# Altium schematic sheet Misc.SchDoc: F1C100S-Misc
size A4
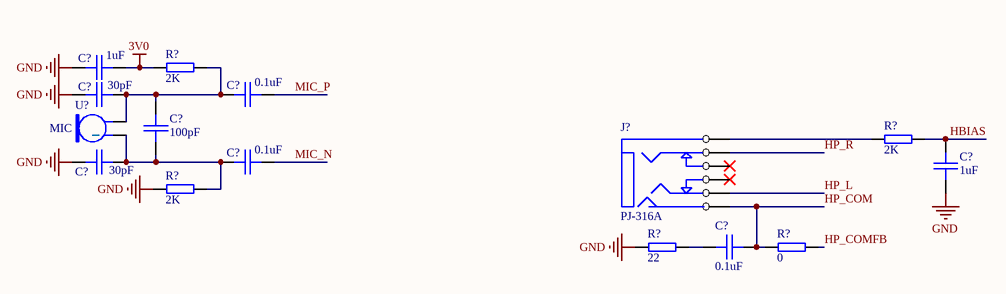
[diagram p0: Misc.SchDoc]

## Parts
(Parts that share a designator on the sheet are numbered #1, #2 ... from top to bottom, then left to right.)
C?#1  1uF  [CAP-0603]
C?#2  30pF  [CAP-0603]
C?#3  0.1uF  [CAP-0603]
C?#4  100pF  [CAP-0603]
C?#5  30pF  [CAP-0603]
C?#6  0.1uF  [CAP-0603]
C?#7  1uF  [CAP-0603]
C?#8  0.1uF  [CAP-0603]
J?  PJ-316A  [PJ-316A]
R?#1  2K  [RES-0603]
R?#2  2K  [RES-0603]
R?#3  2K  [RES-0603]
R?#4  22  [RES-0603]
R?#5  0  [RES-0603]
U?  MIC  [MIC_9767]

## Nets
3V0: C?#1.2 R?#1.1
GND: C?#1.1 C?#2.1 C?#5.1 C?#7.1 R?#3.1 R?#4.1
HBIAS: C?#7.2 R?#2.2
HP_COM: C?#8.2 J?.4(MIC) R?#5.1
HP_COMFB: R?#5.2
HP_L: J?.2(L)
HP_R: J?.3(R)
MIC_N: C?#6.2
MIC_P: C?#3.2
NetC?#2_2: C?#2.2 C?#3.1 C?#4.2 R?#1.2 U?.2
NetC?#4_1: C?#4.1 C?#5.2 C?#6.1 R?#3.2 U?.1
NetC?#8_1: C?#8.1 R?#4.2
NetJ?_1: J?.1(GND) R?#2.1

Not connected (* = marked no-connect by the designer): J? 5(L_DET)* 6(R_DET)*

## Notes on the sheet
- Title
- Size:
- Date:
- A4
- Number:
- Time:
- Revision:
- Sheet
- of
- File:

## Library data of the parts
C?#1-C?#8 = C_0603: 陶瓷贴片电容0603; tolerance: 10%; voltage: 50V; ESR: 1.73mOhm; IRMS: 5.59A; Series: X7R
  C?#1 C?#7: C_value: 1uF
  C?#2 C?#5: C_value: 30pF
  C?#3 C?#6 C?#8: C_value: 0.1uF
  C?#4: C_value: 100pF
J? = PJ-316A: 音频接口，左右声道+麦克
R?#1-R?#5 = R_0603: 贴片电阻0603; tolerance: 5%; voltage: 50V; power: 0.063W
  R?#1-R?#3: R_value: 2K
  R?#4: R_value: 22
  R?#5: R_value: 0
U? = MIC: 咪头